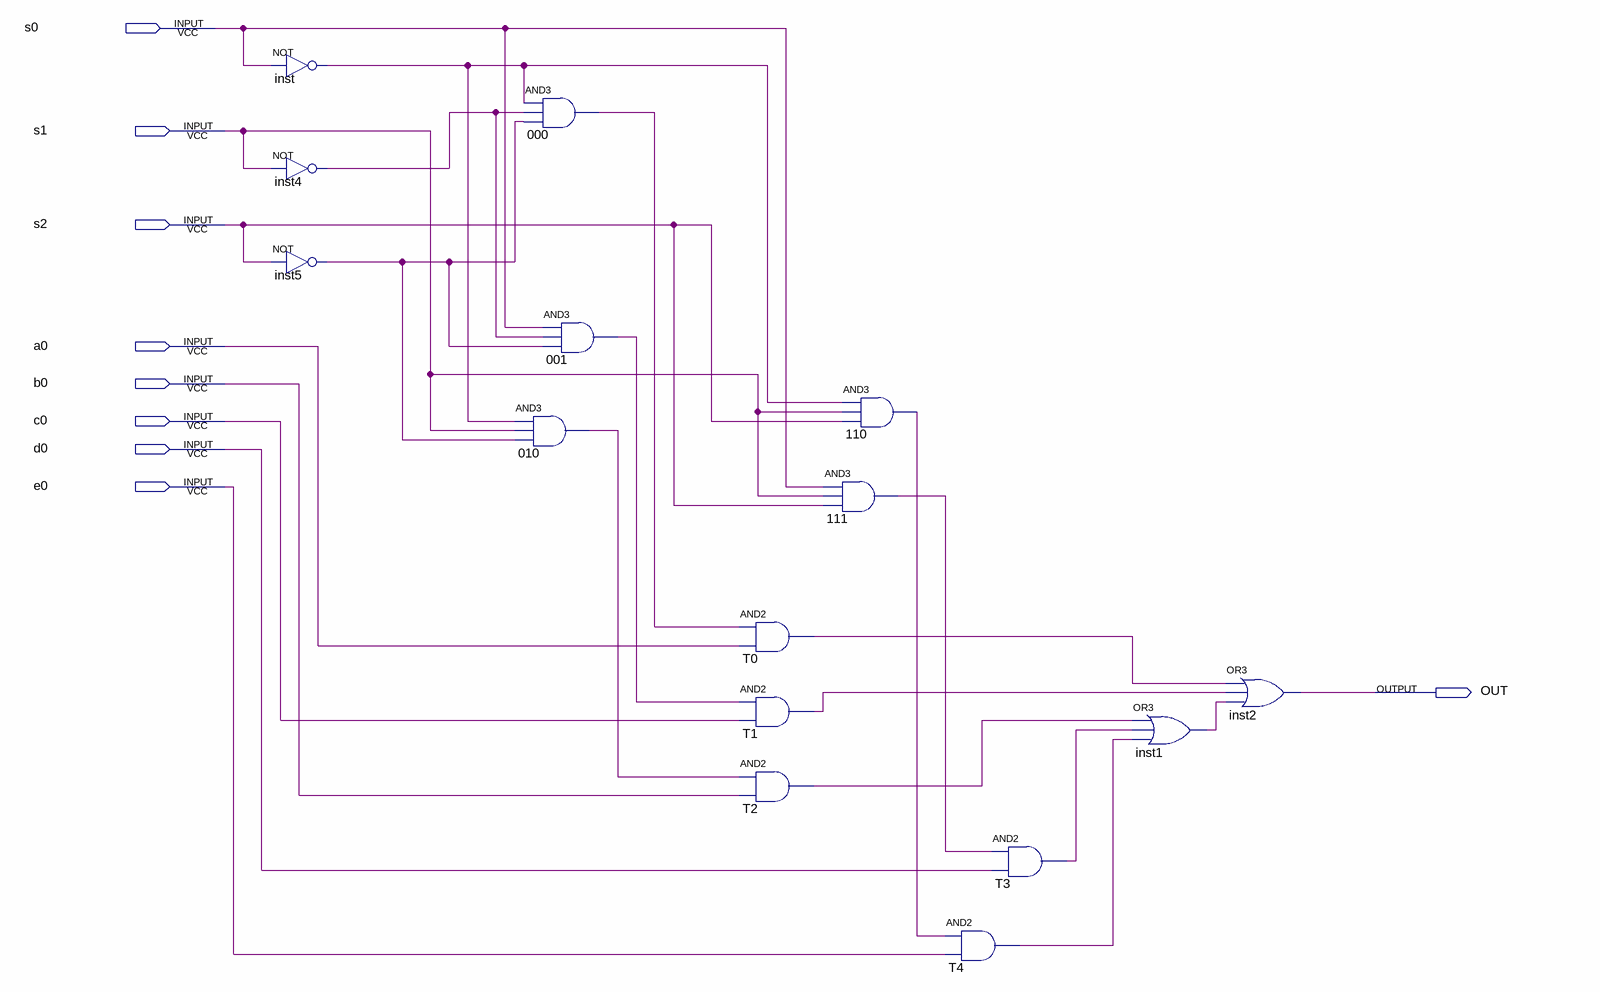
[diagram p0: schematic sheet]
// Quartus schematic MUX_Intermediario_operacoes_6bits.bdf as structural Verilog: 15 symbols, 9 pins
module MUX_Intermediario_operacoes_6bits (
  input  s0,
  input  s1,
  input  s2,
  input  a0,
  input  b0,
  input  c0,
  input  d0,
  input  e0,
  output OUT
);

  wire inst1_out, inst4_out, inst5_out, inst_out, n000_out, n001_out, n010_out, n110_out, n111_out, T0_out,
       T1_out, T2_out, T3_out, T4_out;

  not inst (inst_out, s0);
  not inst4 (inst4_out, s1);
  not inst5 (inst5_out, s2);
  and u_000 (n000_out, inst_out, inst4_out, inst5_out);
  and u_001 (n001_out, s0, inst4_out, inst5_out);
  and u_010 (n010_out, inst_out, s1, inst5_out);
  and T0 (T0_out, n000_out, a0);
  and T1 (T1_out, n001_out, c0);
  and T2 (T2_out, n010_out, b0);
  and u_110 (n110_out, inst_out, s1, s2);
  and u_111 (n111_out, s0, s1, s2);
  and T4 (T4_out, n110_out, e0);
  and T3 (T3_out, n111_out, d0);
  or inst1 (inst1_out, T2_out, T3_out, T4_out);
  or inst2 (OUT, T0_out, T1_out, inst1_out);
endmodule
